# EasyEDA Pro project ProPrj_AD8302鉴相器_2025-07-18.epro

# Schematic Schematic1
Create Date: 2023-07-26; Page Name: P1; Project Name: AD8302鉴相器; Schematic Name: Schematic1; Update Date: 2023-07-27; Company: 嘉立创EDA; Page Size: A4; Version: V1.0
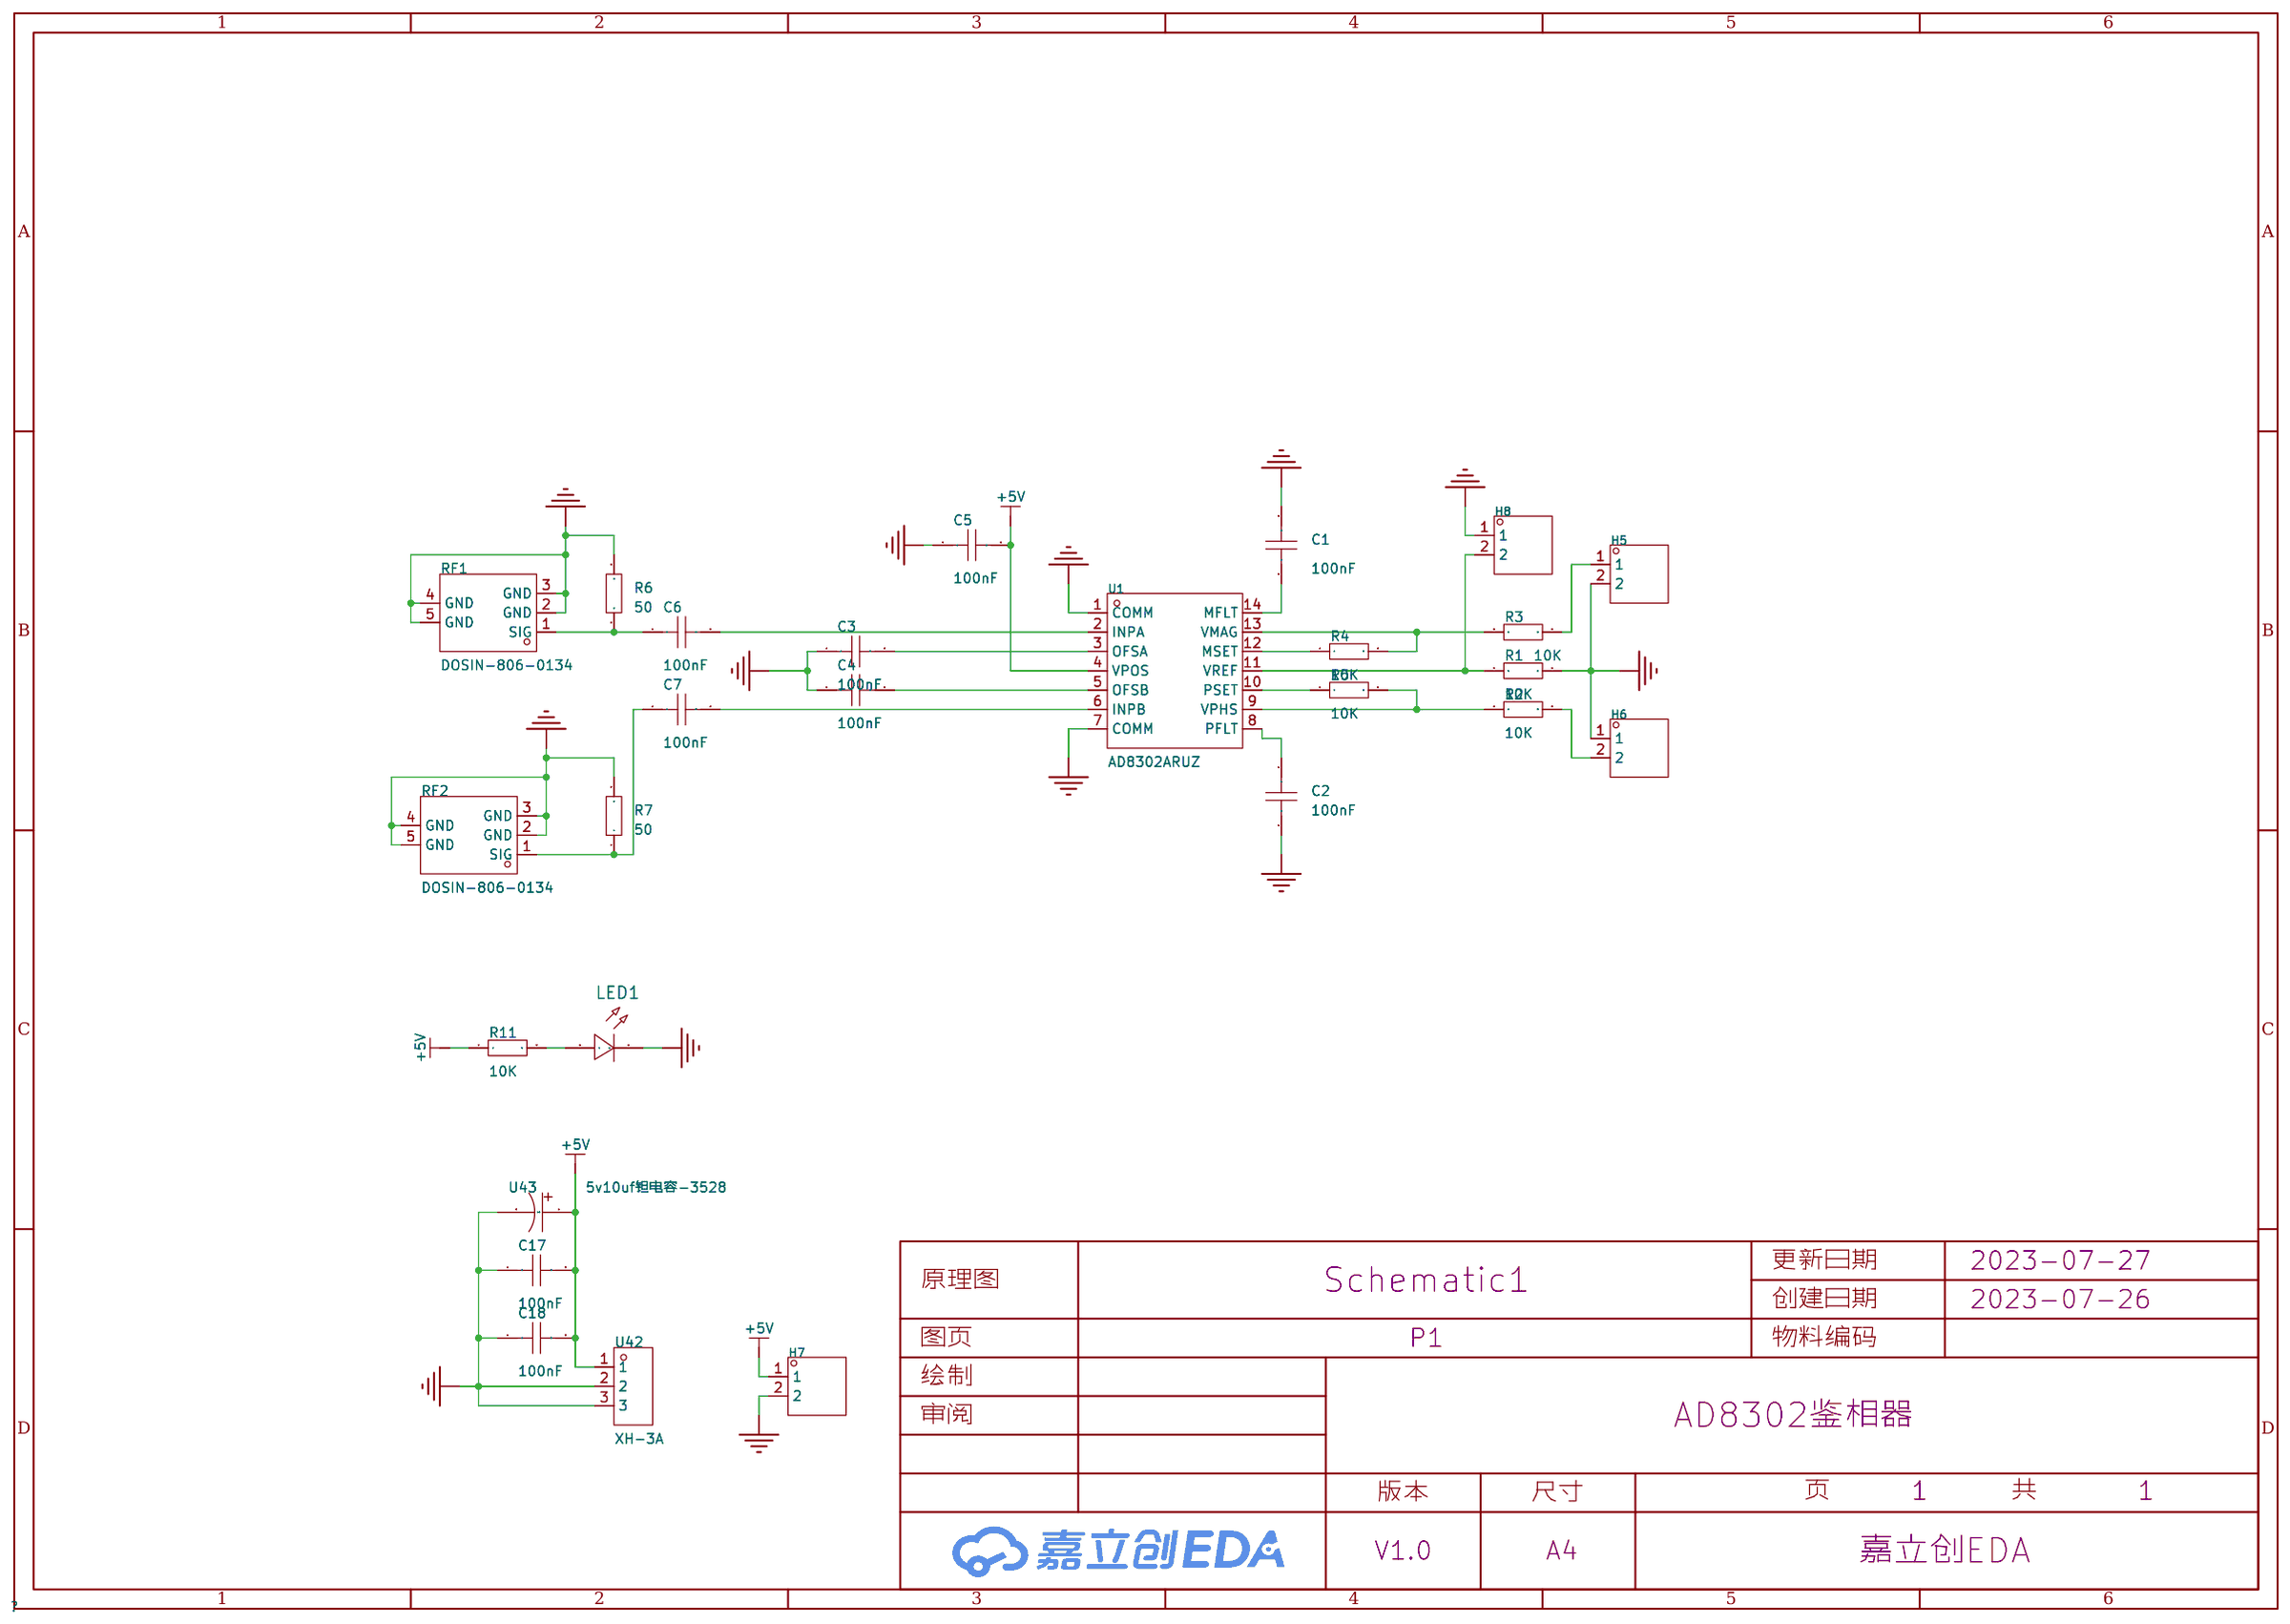
[diagram p0: schematic sheet]

## Parts
C1  100nF  [C0603]
C2  100nF  [C0603]
C3  100nF  [C0603]
C4  100nF  [C0603]
C5  100nF  [C0603]
C6  100nF  [C0603]
C7  100nF  [C0603]
C17  100nF  [C0603]
C18  100nF  [C0603]
H5  -  [HDR-TH_2P-P2.54-V-M-1]
H6  -  [HDR-TH_2P-P2.54-V-M-1]
H7  -  [HDR-TH_2P-P2.54-V-M-1]
H8  -  [HDR-TH_2P-P2.54-V-M-1]
LED1  -  [LED_0603]
R1  10K  [R0603]
R2  10K  [R0603]
R3  10K  [R0603]
R4  10K  [R0603]
R5  10K  [R0603]
R6  50  [R0603]
R7  50  [R0603]
R11  10K  [R0603]
RF1  DOSIN-806-0134  [SMA-SMD_DOSIN-806-0134]
RF2  DOSIN-806-0134  [SMA-SMD_DOSIN-806-0134]
U1  AD8302ARUZ  [TSSOP-14_L5.0-W4.4-P0.65-LS6.4-BL]
U42  XH-3A  [CONN-TH_3P-P2.50_C9900023074]
U43  5v10uf钽电容-3528  [CAP-SMD_L3.5-W2.8]

## Library data of the parts
C1-C7 C17 C18 = CAP_0603: Supplier Footprint: 0603
H5-H8 = HDR-M_2.54_1x2P: Supplier Part: C124375; Supplier Footprint: 插件
LED1 = LED_0603-R: Supplier Footprint: 0603
R1-R7 R11 = Res_0603: Supplier Footprint: 0603
RF1 RF2 = DOSIN-806-0134: 连接器类型:板端;射频系列:SMA;接口类型:内孔;端口数量:1;阻抗:50Ω;频率-最大值:6GHz;样式:偏脚;接口直径:5.3mm;接口长度/高度:-;工作温度范围:-55℃~+155℃;; LCSC Part Name: SMA 内孔 偏脚 1代; Supplier Part: C709670; Manufacturer: dosinconn(德索五金); Supplier Footprint: 插件; JLCPCB Part Class: Extended Part; Datasheet: https://atta.szlcsc.com/upload/public/pdf/source/20200723/C709670_D021C61B6AD3B45D51C78580F7E7A7EA.pdf; Supplier: LCSC; Connector Type: 板端; RF Series: SMA; Interface Type: 内孔; Number of Ports: 1; Impedance: 50Ω; Frequency-Max: 6GHz; Style: 偏脚; Interface Diameter: 5.3mm; Operating Temperature Range: -55℃~+155℃
U1 = AD8302ARUZ: 应用领域:通用;频率范围:2.7GHz;输入范围:-60dBm~0dBm;精度:±0.5dB;; Supplier Part: C578682; Manufacturer: ADI(亚德诺); Supplier Footprint: TSSOP-14; JLCPCB Part Class: Extended Part; Datasheet: https://atta.szlcsc.com/upload/public/pdf/source/20190807/C408900_5BB3D180A454BA6F4D99553AB0F529A5.pdf; Supplier: LCSC; Applications: 通用; Frequency Range: 2.7GHz; Supply Voltage: 2.7V~5.5V; Supply Current: 23mA; Input Range: -60dBm~0dBm; Accuracy: ±0.5dB
U42 = XH-3A_C9900023074: Supplier Part: C9900023074; Supplier Footprint: XH2.54-3P; JLCPCB Part Class: Extended Part; Supplier: LCSC
U43 = 5v10uf钽电容-3528: Supplier Part: C9900010526; Supplier Footprint: CAP-SMD_3528; JLCPCB Part Class: Extended Part; Datasheet: https://atta.szlcsc.comnull; Supplier: LCSC

## Nets
+5V: C5.2 C17.2 C18.2 H7.1 R11.1 U1.4(VPOS) U42.1 U43.1
GND: C1.2 C2.1 C3.1 C4.1 C5.1 C17.1 C18.1 H5.2 H6.1 H7.2 H8.1 LED1.1(C) R1.2 R6.2 R7.2 RF1.2(GND) RF1.3(GND) RF1.4(GND) RF1.5(GND) RF2.2(GND) RF2.3(GND) RF2.4(GND) RF2.5(GND) U1.1(COMM) U1.7(COMM) U42.2 U42.3 U43.2
$1N461: C1.1 U1.14(MFLT)
$1N471: C2.2 U1.8(PFLT)
$1N495: R4.1 U1.12(MSET)
$1N504: R3.1 R4.2 U1.13(VMAG)
$1N516: R5.1 U1.10(PSET)
$1N519: R2.1 R5.2 U1.9(VPHS)
$1N577: H5.1 R3.2
$1N582: H6.2 R2.2
$1N733: C4.2 U1.5(OFSB)
$1N750: C3.2 U1.3(OFSA)
$1N1045: C6.1 R6.1 RF1.1(SIG)
$1N1048: C6.2 U1.2(INPA)
$1N1051: C7.1 R7.1 RF2.1(SIG)
$1N1056: C7.2 U1.6(INPB)
$1N1226: LED1.2(A) R11.2
$1N2103: H8.2 R1.1 U1.11(VREF)

# Board PCB1
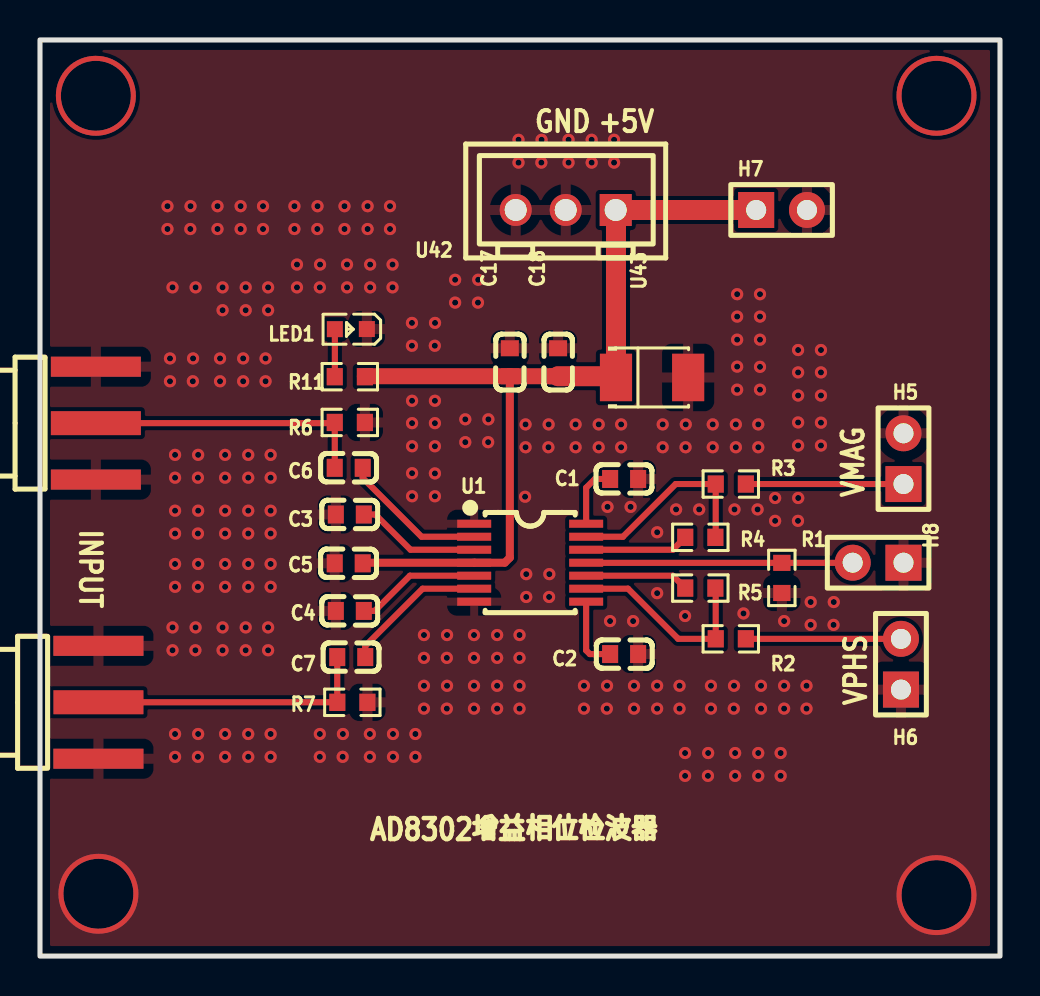
[diagram p1: board, top side]
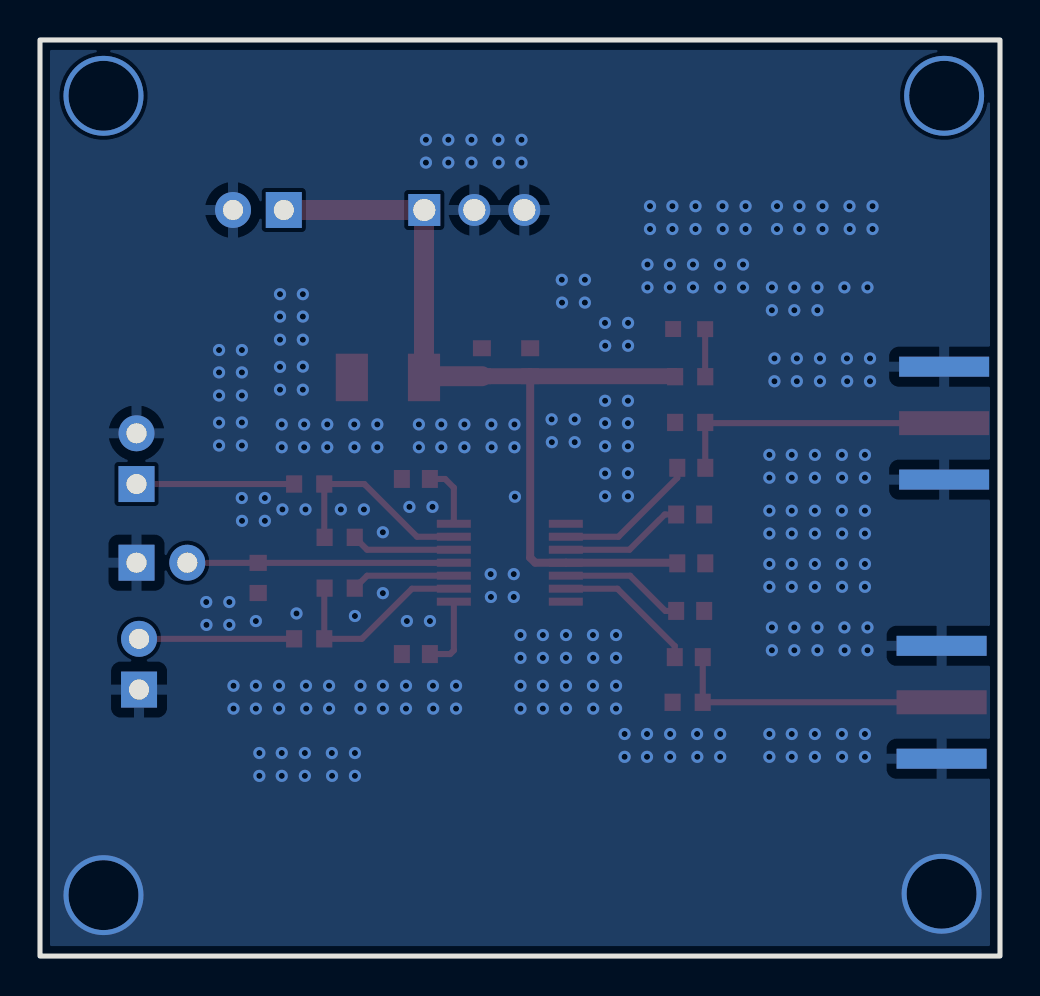
[diagram p2: board, bottom side, seen from below]

Outline 48.01 x 45.85 mm; copper layers: Top Layer, Bottom Layer. Coordinates in mm from the lower left corner of the outline.
Outline path: rectangle 0,45.85 48.01,0
Stack: Top Layer 0.035mm / Dielectric1 1.51mm FR4 er 4.5 / Bottom Layer 0.035mm

## Design rules (mm)
template: JLCPCB Capability(Two Layers Board)
spacing copperThickness1oz (default): track to track 0.102, other pairs 0.152 to 0.3
spacing copperThickness2oz: track to track 0.203, other pairs 0.152 to 0.3
track width copperThickness1oz (default): min 0.127, default 0.254, max 2.54
track width copperThickness2oz: min 0.203, default 0.254, max 2.54
differential pair differentialPair (default): width min 0.127, default 0.254, max 2.54; gap min 0.152, default 0.152
via viaSize (default): diameter min 0.5, default 0.61, max 10; hole min 0.3, default 0.305, max 6.3

## Placement (name value [footprint] x y rotation side)
C1  100nF  [C0603]  29.21 23.88 0 top
C2  100nF  [C0603]  29.21 15.11 180 top
C3  100nF  [C0603]  15.49 22.1 0 top
C4  100nF  [C0603]  15.49 17.27 0 top
C5  100nF  [C0603]  15.44 19.65 0 top
C6  100nF  [C0603]  15.44 24.44 0 top
C7  100nF  [C0603]  15.56 14.96 0 top
C17  100nF  [C0603]  23.5 29.72 270 top
C18  100nF  [C0603]  25.91 29.72 270 top
H5  -  [HDR-TH_2P-P2.54-V-M-1]  43.18 24.89 90 top
H6  -  [HDR-TH_2P-P2.54-V-M-1]  43.05 14.6 90 top
H7  -  [HDR-TH_2P-P2.54-V-M-1]  37.08 37.34 0 top
H8  -  [HDR-TH_2P-P2.54-V-M-1]  41.91 19.69 180 top
LED1  -  [LED_0603]  15.49 31.37 180 top
R1  10K  [R0603]  37.1 18.92 270 top
R2  10K  [R0603]  34.54 15.88 0 top
R3  10K  [R0603]  34.54 23.62 0 top
R4  10K  [R0603]  33.02 20.95 0 top
R5  10K  [R0603]  33.02 18.41 0 top
R6  50  [R0603]  15.49 26.7 0 top
R7  50  [R0603]  15.62 12.7 0 top
R11  10K  [R0603]  15.49 28.99 180 top
RF1  DOSIN-806-0134  [SMA-SMD_DOSIN-806-0134]  2.79 26.67 90 top
RF2  DOSIN-806-0134  [SMA-SMD_DOSIN-806-0134]  2.92 12.7 90 top
U1  AD8302ARUZ  [TSSOP-14_L5.0-W4.4-P0.65-LS6.4-BL]  24.51 19.69 270 top
U42  XH-3A  [CONN-TH_3P-P2.50_C9900023074]  26.29 37.34 0 top
U43  5v10uf钽电容-3528  [CAP-SMD_L3.5-W2.8]  30.61 28.96 180 top

## Footprints (pads in the part's own frame, mm; a bottom-side part is the same pattern mirrored in y, then rotated)
C0603
  rect 0.8x0.9 smd: 1(-0.7,0) 2(0.7,0)
CAP-SMD_L3.5-W2.8
  rect 1.607x2.376 smd: 1(1.804,0) 2(-1.804,0)
CONN-TH_3P-P2.50_C9900023074
  rect 1.6x1.6 hole 1.1: 1(2.5,0)
  round 1.6 hole 1.1: 2(0.001,0) 3(-2.5,0)
HDR-TH_2P-P2.54-V-M-1
  rect 1.8x1.8 hole 1: 1(-1.27,0)
  round 1.8 hole 1: 2(1.27,0)
LED_0603
  rect 0.8x0.8 smd: 1(-0.851,-0.01) 2(0.75,-0.005)
R0603
  rect 0.806x0.864 smd: 1(-0.753,0) 2(0.753,0)
SMA-SMD_DOSIN-806-0134
  rect 1.2x4.5 smd: 1(0,0)
  rect 1x4.5 smd: 2(-2.825,0) 3(2.825,0)
  rect 1x4.5 smd far side: 4(-2.825,0) 5(2.825,0)
TSSOP-14_L5.0-W4.4-P0.65-LS6.4-BL
  rect 0.4x1.7 smd: 1(-1.95,-2.8) 2(-1.3,-2.8) 3(-0.65,-2.8) 4(0,-2.8) 5(0.65,-2.8) 6(1.3,-2.8) 7(1.95,-2.8) 8(1.95,2.8) 9(1.3,2.8) 10(0.65,2.8) 11(0,2.8) 12(-0.65,2.8) 13(-1.3,2.8) 14(-1.95,2.8)

## Nets
As in the schematic.

## Via types
v1: diameter 4, hole 3.5, Top Layer to Bottom Layer, 4 vias
v2: diameter 0.61, hole 0.305, Top Layer to Bottom Layer, 256 vias

## Routing (per net, layer and track width the routed paths; a pad name or vN(x,y) marks a point on that pad's centre or on a via; arc(x,y) is an arc through that point)
+5V: length 44.6
  Top Layer w0.305: 23.5,29.15 C17.2
  Top Layer w0.4: C17.2 23.5,19.94 23.24,19.69 U1.4 16.14,19.69
  Top Layer w0.8: C18.2 C17.2 16.25,29.02
  Top Layer w1: H7.1 U42.1 28.8,37.32 28.8,29.02 C18.2
GND:
  vias: v1(2.92,3.12) v1(44.83,3.05) v2(6.37,37.53) v2(6.37,36.39) v2(6.5,29.91) v2(6.5,28.77) v2(6.63,33.46) v2(6.63,16.45) v2(6.63,15.3) v2(6.75,25.08) v2(6.75,23.94) v2(6.75,22.29) v2(6.75,21.15) v2(6.75,19.62) v2(6.75,18.48) v2(6.75,11.11) v2(6.75,9.97) v2(7.53,37.53) v2(7.52,36.39) v2(7.65,29.91) v2(7.64,28.77) v2(7.78,33.46) v2(7.78,16.45) v2(7.77,15.3) v2(7.91,25.08) v2(7.9,23.94) v2(7.91,22.29) v2(7.9,21.15) v2(7.91,19.62) v2(7.9,18.48) v2(7.91,11.11) v2(7.9,9.97) v2(8.88,37.53) v2(8.88,36.39) v2(9,29.91) v2(9,28.77) v2(9.13,33.46) v2(9.13,32.32) v2(9.13,16.45) v2(9.13,15.3) v2(9.26,25.08) v2(9.26,23.94) v2(9.26,22.29) v2(9.26,21.15) v2(9.26,19.62) v2(9.26,18.48) v2(9.26,11.11) v2(9.26,9.97) v2(10.03,37.53) v2(10.03,36.39) v2(10.16,29.91) v2(10.16,28.77) v2(10.29,33.46) v2(10.29,32.32) v2(10.29,16.45) v2(10.29,15.3) v2(10.41,25.08) v2(10.41,23.94) v2(10.41,22.29) v2(10.41,21.15) v2(10.41,19.62) v2(10.41,18.48) v2(10.41,11.11) v2(10.41,9.97) v2(11.15,37.53) v2(11.15,36.39) v2(11.28,29.91) v2(11.28,28.77) v2(11.41,33.46) v2(11.41,32.32) v2(11.41,16.45) v2(11.41,15.3) v2(11.53,25.08) v2(11.53,23.94) v2(11.53,22.29) v2(11.53,21.15) v2(11.53,19.62) v2(11.53,18.48) v2(11.53,11.11) v2(11.53,9.97) v2(12.72,37.53) v2(12.72,36.39) v2(12.85,34.61) v2(12.85,33.46) v2(13.88,37.53) v2(13.87,36.39) v2(14,34.61) v2(13.99,33.46) v2(13.99,11.11) v2(13.99,9.97) v2(15.15,11.11) v2(15.14,9.97) v2(15.23,37.53) v2(15.23,36.39) v2(15.35,34.61) v2(15.35,33.46) v2(16.38,37.53) v2(16.38,36.39) v2(16.51,34.61) v2(16.51,33.46) v2(16.5,11.11) v2(16.5,9.97) v2(17.5,37.53) v2(17.5,36.39) v2(17.63,34.61) v2(17.63,33.46) v2(17.65,11.11) v2(17.65,9.97) v2(18.6,31.69) v2(18.6,30.54) v2(18.61,27.79) v2(18.61,26.67) v2(18.61,25.51) v2(18.61,24.16) v2(18.61,23.01) v2(18.77,11.11) v2(18.77,9.97) v2(19.2,16.07) v2(19.2,14.92) v2(19.2,13.53) v2(19.2,12.38) v2(19.75,31.69) v2(19.74,30.54) v2(19.75,27.79) v2(19.75,26.67) v2(19.75,25.51) v2(19.75,24.15) v2(19.75,23.01) v2(20.35,16.07) v2(20.34,14.92) v2(20.35,13.53) v2(20.34,12.38) v2(20.76,33.85) v2(20.76,32.7) v2(21.27,26.86) v2(21.27,25.72) v2(21.7,16.07) v2(21.7,14.92) v2(21.7,13.53) v2(21.7,12.38) v2(21.9,32.7) v2(21.91,33.85) v2(22.42,26.86) v2(22.41,25.72) v2(22.86,16.07) v2(22.86,14.92) v2(22.86,13.53) v2(22.86,12.38) v2(23.93,40.85) v2(23.93,39.71) v2(23.98,16.07) v2(23.98,14.92) v2(23.98,13.53) v2(23.98,12.38) v2(24.28,26.61) v2(24.28,25.46) v2(24.26,22.99) v2(24.31,19.11) v2(24.31,17.97) v2(25.08,40.85) v2(25.07,39.71) v2(25.43,26.61) v2(25.42,25.46) v2(25.47,19.11) v2(25.46,17.97) v2(26.43,40.85) v2(26.43,39.71) v2(26.78,26.61) v2(26.78,25.46) v2(27.2,13.53) v2(27.2,12.38) v2(27.59,40.85) v2(27.59,39.71) v2(27.94,26.61) v2(27.94,25.46) v2(28.38,22.48) v2(28.36,13.53) v2(28.34,12.38) v2(28.51,16.76) v2(28.71,40.85) v2(28.71,39.71) v2(29.06,26.61) v2(29.06,25.46) v2(29.53,22.48) v2(29.66,16.76) v2(29.7,13.53) v2(29.7,12.38) v2(30.86,21.21) v2(30.86,18.16) v2(30.86,13.53) v2(30.86,12.38) v2(31.14,26.61) v2(31.14,25.46) v2(31.81,22.35) v2(31.98,13.53) v2(31.98,12.38) v2(32.29,26.61) v2(32.28,25.46) v2(32.26,17.02) v2(32.26,10.16) v2(32.26,9.02) v2(32.96,22.35) v2(33.4,9.02) v2(33.41,10.16) v2(33.55,13.53) v2(33.55,12.38) v2(33.64,26.61) v2(33.64,25.46) v2(34.71,13.53) v2(34.69,12.38) v2(34.8,26.61) v2(34.8,25.46) v2(34.73,22.35) v2(34.76,10.16) v2(34.76,9.02) v2(34.86,33.12) v2(34.86,32) v2(34.86,30.85) v2(34.86,29.5) v2(34.86,28.34) v2(35.18,17.14) v2(35.88,22.35) v2(36,33.12) v2(36,32) v2(36,30.85) v2(36,29.49) v2(36,28.34) v2(35.92,26.61) v2(35.92,25.46) v2(35.92,10.16) v2(35.92,9.02) v2(36.05,13.53) v2(36.05,12.38) v2(36.76,22.92) v2(36.76,21.78) v2(37.04,10.16) v2(37.04,9.02) v2(37.21,16.76) v2(37.21,13.53) v2(37.21,12.38) v2(37.91,30.33) v2(37.91,29.21) v2(37.91,28.05) v2(37.91,26.7) v2(37.91,25.55) v2(37.9,21.78) v2(37.91,22.92) v2(38.33,13.53) v2(38.33,12.38) v2(38.54,17.72) v2(38.54,16.57) v2(39.05,30.33) v2(39.05,29.21) v2(39.05,28.05) v2(39.05,26.69) v2(39.05,25.55) v2(39.69,17.72) v2(39.68,16.57)
(no net):
  vias: v1(2.79,43.05) v1(44.83,43.05)
$1N461: length 3.2
  Top Layer w0.305: C1.1 27.75,23.88 27.31,23.44 27.31,21.63
$1N471: length 3.7
  Top Layer w0.305: U1.8 27.31,15.3 27.49,15.11 C2.2
$1N495: length 5.2
  Top Layer w0.305: R4.1 31.65,20.33 27.31,20.33
$1N504: length 10.2
  Top Layer w0.305: U1.13 29.15,20.98 31.79,23.62 R3.1 33.79,20.97 R4.2
$1N516: length 5.2
  Top Layer w0.305: U1.10 31.65,19.03 R5.1
$1N519: length 10.1
  Top Layer w0.305: U1.9 29.4,18.38 31.91,15.88 R2.1 33.79,18.4 R5.2
$1N577: length 7.9
  Top Layer w0.305: R3.2 H5.1
$1N582: length 7.8
  Top Layer w0.305: R2.2 H6.2
$1N733: length 6.2
  Top Layer w0.305: C4.2 16.74,17.27 18.5,19.03 U1.5
$1N750: length 6.2
  Top Layer w0.305: 21.71,20.33 18.53,20.33 16.76,22.1 C3.2
$1N1045: length 14.2
  Top Layer w0.305: RF1.1 14.74,26.67 ; 14.74,26.67 R6.1 ; 14.74,26.67 14.74,24.44
$1N1048: length 7.3
  Top Layer w0.305: U1.2 19.08,20.98 16.14,23.93 C6.2
$1N1051: length 14.2
  Top Layer w0.305: C7.1 14.86,12.7 ; 14.86,12.7 RF2.1 ; 14.86,12.7 14.86,12.7
$1N1056: length 7.2
  Top Layer w0.305: C7.2 16.26,15.52 19.13,18.38 U1.6
$1N1226: length 2.4
  Top Layer w0.305: LED1.2 14.74,28.99
$1N2103: length 13.3
  Top Layer w0.305: 27.31,19.68 R1.1 40.64,19.68

## Copper pours and planes (outline as drawn; the poured copper is in the pictures)
GND on Top Layer: -10.16,52.2 61.47,52.2 61.47,-14.99 -10.16,-14.99
GND on Bottom Layer: -12.32,51.31 55.63,51.31 55.63,-8.38 -12.32,-8.38

## Text on the board
Top Silkscreen Layer: VMAG | VPHS | INPUT | GND | +5V | AD8302增益相位检波器
